# Altium schematic sheet JK_FF_WITH_AND.SchDoc
size A
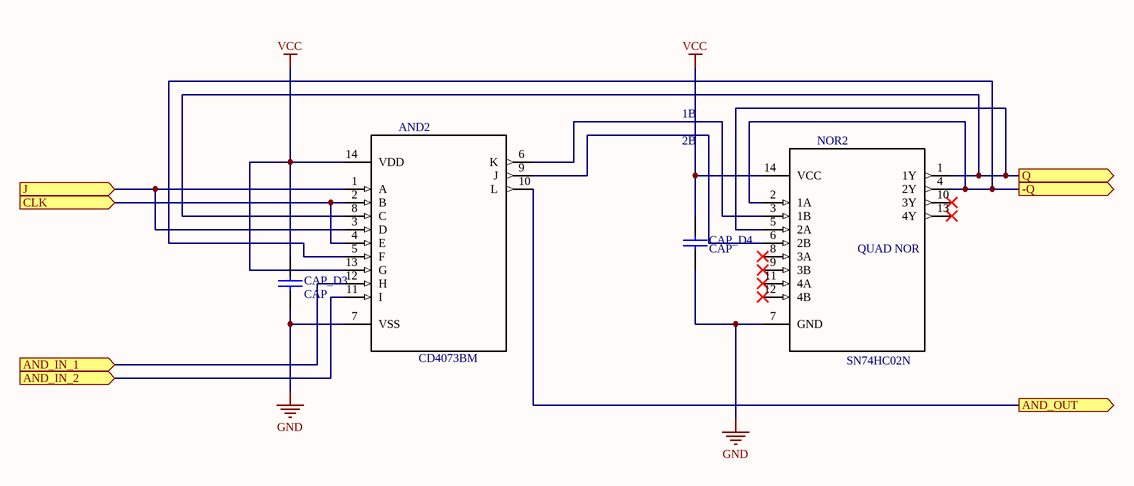
[diagram p0: JK_FF_WITH_AND.SchDoc]

## Parts
AND2  CD4073BM  [*SOIC127P600X175-14N]
CAP_D3  CAP  [CAP200]
CAP_D4  CAP  [CAP200]
NOR2  SN74HC02N  [*DIP254P762X508-14]

## Ports
-Q (out), AND_IN_1 (in), AND_IN_2 (in), AND_OUT (out), CLK (in), J (in), Q (out)

## Nets
GND: AND2.7(VSS) CAP_D3.2 CAP_D4.2 NOR2.7(GND)
VCC: AND2.13(G) AND2.14(VDD) CAP_D3.1 CAP_D4.1 NOR2.14(VCC)
-Q: AND2.5(F) NOR2.2(1A) NOR2.4(2Y) ; port -Q
AND_IN_1: AND2.12(H) ; port AND_IN_1
AND_IN_2: AND2.11(I) ; port AND_IN_2
AND_OUT: AND2.10(L) ; port AND_OUT
CLK: AND2.2(B) AND2.4(E) ; port CLK
J: AND2.1(A) AND2.3(D) ; port J
Q: AND2.8(C) NOR2.1(1Y) NOR2.5(2A) ; port Q
NetAND2_6: AND2.6(K) NOR2.3(1B)
NetAND2_9: AND2.9(J) NOR2.6(2B)

Not connected (* = marked no-connect by the designer): NOR2 8(3A)* 9(3B)* 10(3Y)* 11(4A)* 12(4B)* 13(4Y)*

## Notes on the sheet
- 1B
- 2B
- (near NOR2) QUAD NOR

## Library data of the parts
AND2 = CD4073BM: IC: digital; AND; Channels: 3; Inputs: 3; CMOS; SMD; SOP1; MF: Texas Instruments; Price: None; Package: SOIC-14 Texas Instruments; Availability: Unavailable; SnapEDA_Link: https://www.snapeda.com/parts/CD4073BM/Texas%20Instruments/view-part/?ref=snap; MP: CD4073BM; Value: *
NOR2 = SN74HC02N: IC: digital; Channels: 4; NOR; Inputs: 2; THT; DIP14; Ser; MF: Texas Instruments; Price: None; Package: DIP-14 Texas Instruments; Availability: Unavailable; SnapEDA_Link: https://www.snapeda.com/parts/SN74HC02N/Texas%20Instruments/view-part/?ref=snap; MP: SN74HC02N; Value: *